# Altium schematic sheet Power supply - Copy (2).SchDoc
size A4; SheetNumber: 2; SheetTotal: 3
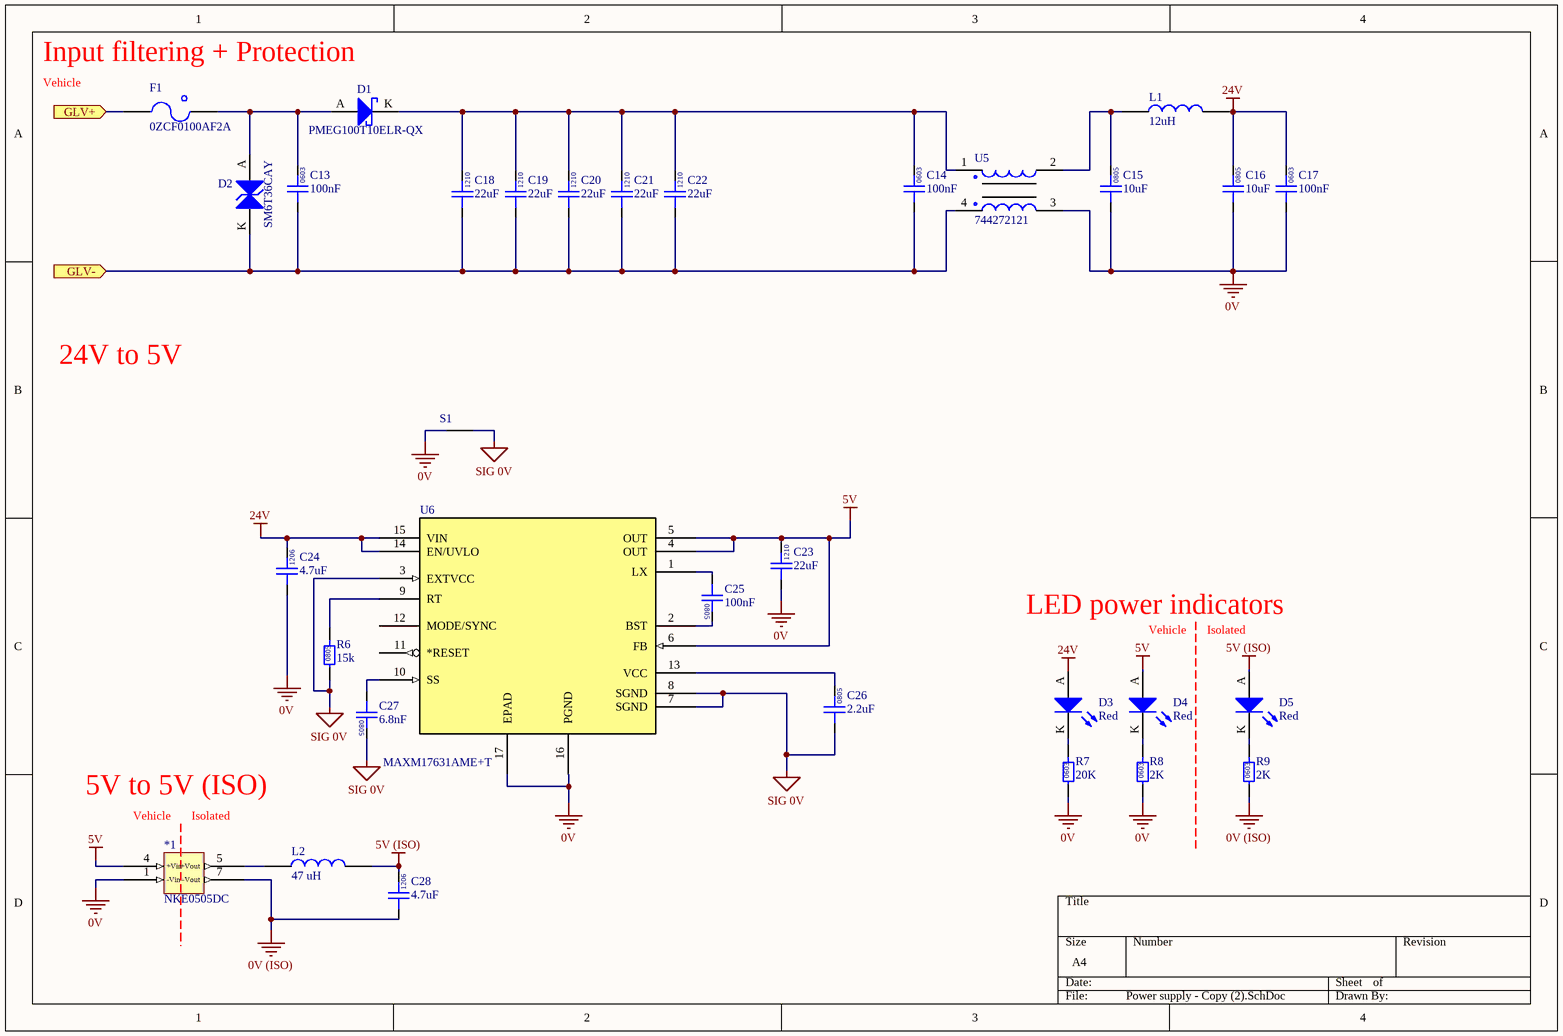
[diagram p0: Power supply - Copy (2).SchDoc]

## Parts
*1  NKE0505DC  [NKE0505DC]
C13  100nF  [0603]
C14  100nF  [0603]
C15  10uF  [0805]
C16  10uF  [0805]
C17  100nF  [0603]
C18  22uF  [1210]
C19  22uF  [1210]
C20  22uF  [1210]
C21  22uF  [1210]
C22  22uF  [1210]
C23  22uF  [1210]
C24  4.7uF  [1206 CAP]
C25  100nF  [0805]
C26  2.2uF  [0805]
C27  6.8nF  [0805]
C28  4.7uF  [1206 CAP]
D1  PMEG100T10ELR-QX  [NXP SOD123W]
D2  SM6T36CAY  [ST SMB DIODE]
D3  Red  [0805 LED]
D4  Red  [0805 LED]
D5  Red  [0805 LED]
F1  0ZCF0100AF2A  [2920]
L1  12uH  [1812]
L2  47 uH  [82473C]
R6  15k  [0805]
R7  20K  [0603]
R8  2K  [0603]
R9  2K  [0603]
S1  (no value)  [POINT_0_1]  (net tie, no BOM)
U5  744272121  [Wurth 4-PC Pad]
U6  MAXM17631AME+T  [MAXM17631AME+T]

## Ports
GLV+ (in), GLV- (in)

## Nets
0V: *1.1(-Vin) C15.1 C16.1 C17.1 C23.1 C24.1 R7.1 R8.1 S1.1 U5.3 U6.16(PGND) U6.17(EPAD)
0V (ISO): *1.7(-Vout) C28.1 R9.1
5V: *1.4(+Vin) C23.2 D4.A U6.4(OUT) U6.5(OUT) U6.6(FB)
5V (ISO): C28.2 D5.A L2.1
24V: C16.2 C17.2 C24.2 D3.A L1.1 U6.14(EN/UVLO) U6.15(VIN)
SIG 0V: C26.1 C27.2 R6.1 S1.2 U6.3(EXTVCC) U6.7(SGND) U6.8(SGND)
GLV+: F1.1 ; port GLV+
GLV-: C13.1 C14.1 C18.1 C19.1 C20.1 C21.1 C22.1 D2.K U5.4 ; port GLV-
Net*1_5: *1.5(+Vout) L2.2
NetC13_2: C13.2 D1.A D2.A F1.2
NetC14_2: C14.2 C18.2 C19.2 C20.2 C21.2 C22.2 D1.K U5.1
NetC15_2: C15.2 L1.2 U5.2
NetC25_1: C25.1 U6.1(LX)
NetC25_2: C25.2 U6.2(BST)
NetC26_2: C26.2 U6.13(VCC)
NetC27_1: C27.1 U6.10(SS)
NetD3_K: D3.K R7.2
NetD4_K: D4.K R8.2
NetD5_K: D5.K R9.2
NetR6_2: R6.2 U6.9(RT)

Not connected (* = marked no-connect by the designer): U6 11(*RESET) 12(MODE/SYNC)

## Notes on the sheet
- Input filtering + Protection
- Vehicle
- 24V to 5V
- Star point grounding for signal GND
- LED power indicators
- Isolated
- (near U6) Css (soft start capacitor) tss = (Css/(5.55*10^-6)) = 1.225ms
- 5V to 5V (ISO)
- (near *1) Vehicle
- (in symbol GCM21BR71H104KA37L) 0805
- (in symbol GCM188L81H104KA57D) 0603
- (in symbol GCM2195C1H682JA16D) 0805
- (in symbol GRM21BR6YA106KE43L) 0805
- (in symbol GRM21BR71E225KE11L) 0805
- (in symbol GRM31CR71H475KA12K) 1206
- (in symbol GRM32ER71E226KE15L) 1210
- (in symbol RC0603FR-072KL) 0603
- (in symbol RC0603FR-0720KL) 0603
- (in symbol RC0805FR0715KL) 0805

## Library data of the parts
*1 = NKE0505DC: DC DC CONVERTER 5V 1W; Manufacturer: Murata Power Solutions Inc.; Input Voltage: 4.5 to 5.5; Output Current: 200 mA; Part Number: NKE0505DC; Output Voltage: 5V; Digikey Part Number: 811-1433-5-ND
C13 C14 C17 = GCM188L81H104KA57D: Manufacturer: muRata; Rated Voltage: 50V; Tolerance: ±10%; Material: MLCC; Temperature Rating: X8L; Part Number: GCM188L81H104KA57D; Value: 100nF; Digikey Part Number: 490-6049-1-ND
C15 C16 = GRM21BR6YA106KE43L: Manufacturer: muRata; Rated Voltage: 50V; Tolerance: 10%; Material: MLCC; Temperature Rating: X5R; Part Number: GRM21BR6YA106KE43L; Value: 10uF; Digikey Part Number: 490-10514-6-ND
C18-C23 = GRM32ER71E226KE15L: Manufacturer: Murata Electronics; Rated Voltage: 25V; Tolerance: ±10%; Material: MLCC; Temperature Rating: X7R; Part Number: GRM32ER71E226KE15L; Value: 22uF; Digikey Part Number: 490-5313-2-ND
C24 C28 = GRM31CR71H475KA12K: Manufacturer: Murata Electronics; Rated Voltage: 50V; Tolerance: ±10%; Material: MLCC; Temperature Rating: X7R; Part Number: GRM31CR71H475KA12K; Value: 4.7uF; Digikey Part Number: 490-GRM31CR71H475KA12KTR-ND
C25 = GCM21BR71H104KA37L: Manufacturer: muRata; Rated Voltage: 50V; Tolerance: ±10%; Material: MLCC; Temperature Rating: X7R; Part Number: GCM21BR71H104KA37L; Value: 100nF; Digikey Part Number: 490-6064-1-ND
C26 = GRM21BR71E225KE11L: Manufacturer: Murata Electronics; Rated Voltage: 25V; Tolerance: ±10%; Material: MLCC; Temperature Rating: X7R; Part Number: GRM21BR71E225KE11L; Value: 2.2uF; Digikey Part Number: 490-14467-2-ND
C27 = GCM2195C1H682JA16D: Manufacturer: muRata; Rated Voltage: 50V; Tolerance: ±5%; Material: MLCC; Temperature Rating: C0G, NP0; Part Number: GCM2195C1H682JA16D; Value: 6.8nF; Digikey Part Number: 490-4974-1-ND
D1 = PMEG100T10ELR-QX: Manufacturer: Nexperia USA Inc.; Forward Voltage: 0.75 V @ 1A; Breakdown Voltage: 100 V; Rated Power: 680 mW; Part Number: PMEG100T10ELR-QX; Digikey Part Number: 1727-PMEG100T10ELR-QXCT-ND
D2 = SM6T36CAY: Manufacturer: STMicroelectronics; Forward Voltage: 30.8 V; Rated Power: 600W; Part Number: SM6T36CAY; Breakdown Voltage: 30.8 V; Digikey Part Number: 497-10804-1-ND
D3-D5 = SML-210LTT86: Red LED Indication - Discrete 1.75V 0805 (2012 Metric); Manufacturer: ROHM Semiconductor; Part Number: SML-210LTT86; Colour: Red; Digikey Part Number: 511-1286-1-ND
F1 = 0ZCF0100AF2A: PTC RESET FUSE 60V 1A 292; Manufacturer: Littelfuse Inc.; Part Number: 0ZCF0100AF2A; Digikey Part Number: 507-2070-1-ND; Digikey Link: https://www.digikey.com/product-detail/en/bel-fuse-inc/0ZCF0100AF2A/507-2070-1-ND/6210547
L1 = RLS-126: Manufacturer: Recom; Tolerance: 0.2; Material: Wirewound; Impedance: 230mOhm; Rated Current: 0.8 A; Part Number: RLS-126; Value: 12uH; Digikey Part Number: 945-3429-ND
L2 = 82473C: Manufacturer: Murata Power Solutions Inc.; Tolerance: 0.1; Impedance: 1.69 Ohms; Rated Current: 250mA; Material: Wirewound; Part Number: 82473C; Value: 47 uH; Digikey Part Number: 811-2477-2-ND
R6 = RC0805FR0715KL: Manufacturer: YAGEO; Tolerance: 0.01; Rated Power: 0.125W; Part Number: RC0805FR0715KL; Value: 15k; Material: FR-07; Digikey Part Number: 311-15.0KCRCT-ND
R7 = RC0603FR-0720KL: Manufacturer: YAGEO; Tolerance: 0.01; Rated Power: 0.1W; Part Number: RC0603FR-0720KL; Value: 20K; Digikey Part Number: 311-20.0KHRCT-ND
R8 R9 = RC0603FR-072KL: Manufacturer: YAGEO; Tolerance: 0.01; Rated Power: 0.1W; Part Number: RC0603FR-072KL; Value: 2K; Digikey Part Number: 311-2.00KHRCT-ND
S1 = STAR_POINT_0.1: Value: 0.1; Part Number: STAR_POINT_0.1
U5 = 744272121: Manufacturer: Wurth Electronics Inc; Value: 120uH @ 100kHz; Impedance: 460 Ohms @ 30MHz; Rated Current: 2.5 A; Part Number: 744272121; Material: Wirewound; Digikey Part Number: 732-1489-1-ND
U6 = MAXM17631AME+T: DC DC CONVERTER 5V; Mfr_Name: Analog Devices Inc; Manufacturer: Analog Devices; Input Voltage: 4.5 to 36 V; Output Current: 1.0 A; Digi-Key_Part_Number_1: 175-MAXM17631AME+TTR-ND; RefDes: RefDes; Type: Type; Part Number: MAXM17631AME+T; Output Voltage: 5V; Digikey Part Number: 175-MAXM17631AME+TTR-ND